# EAGLE schematic oresat-camera-card-v0 (EAGLE 9.4.2)
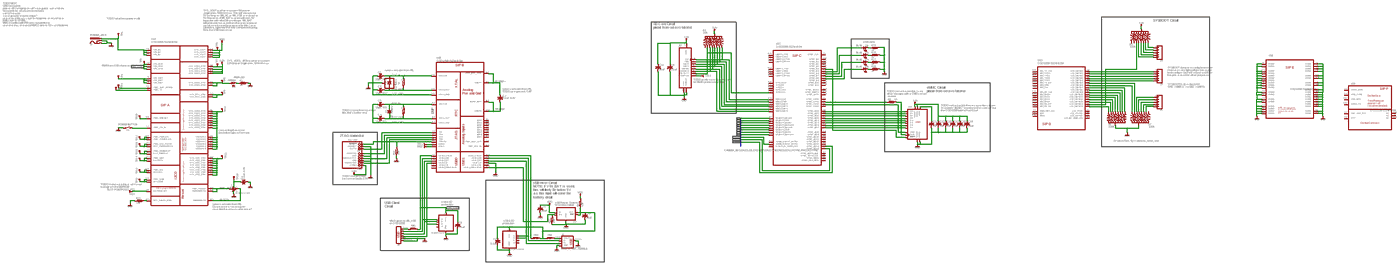
[diagram p0: schematic, sheet 1, overview]
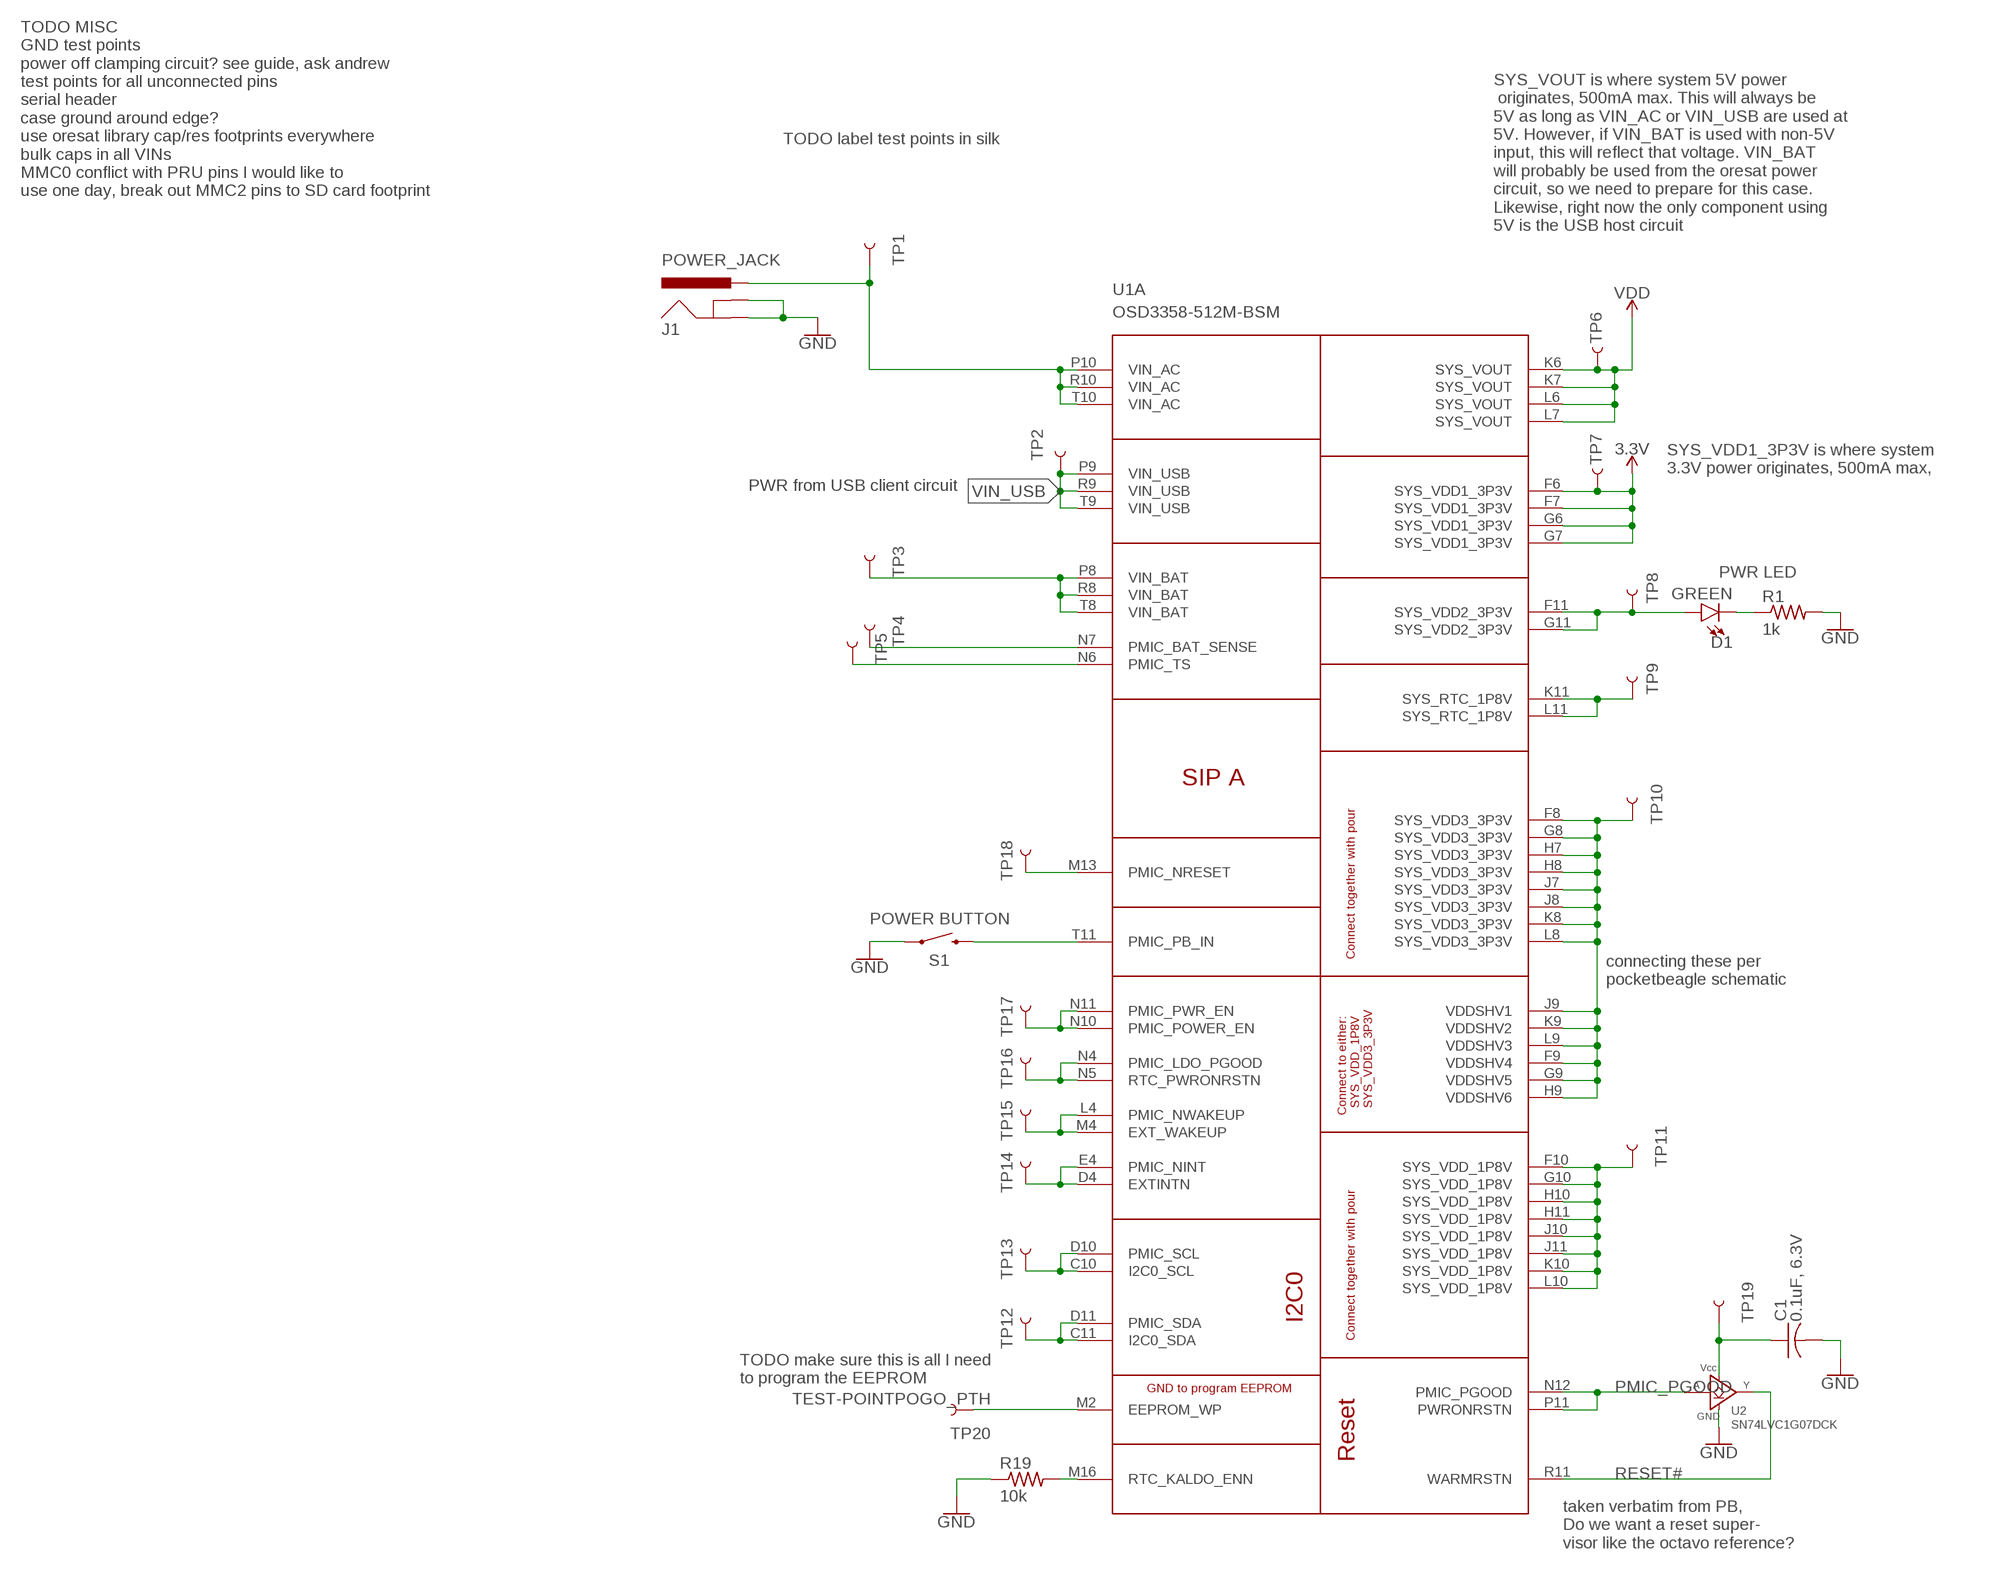
[diagram p1: schematic, sheet 1, part 1 of 4]
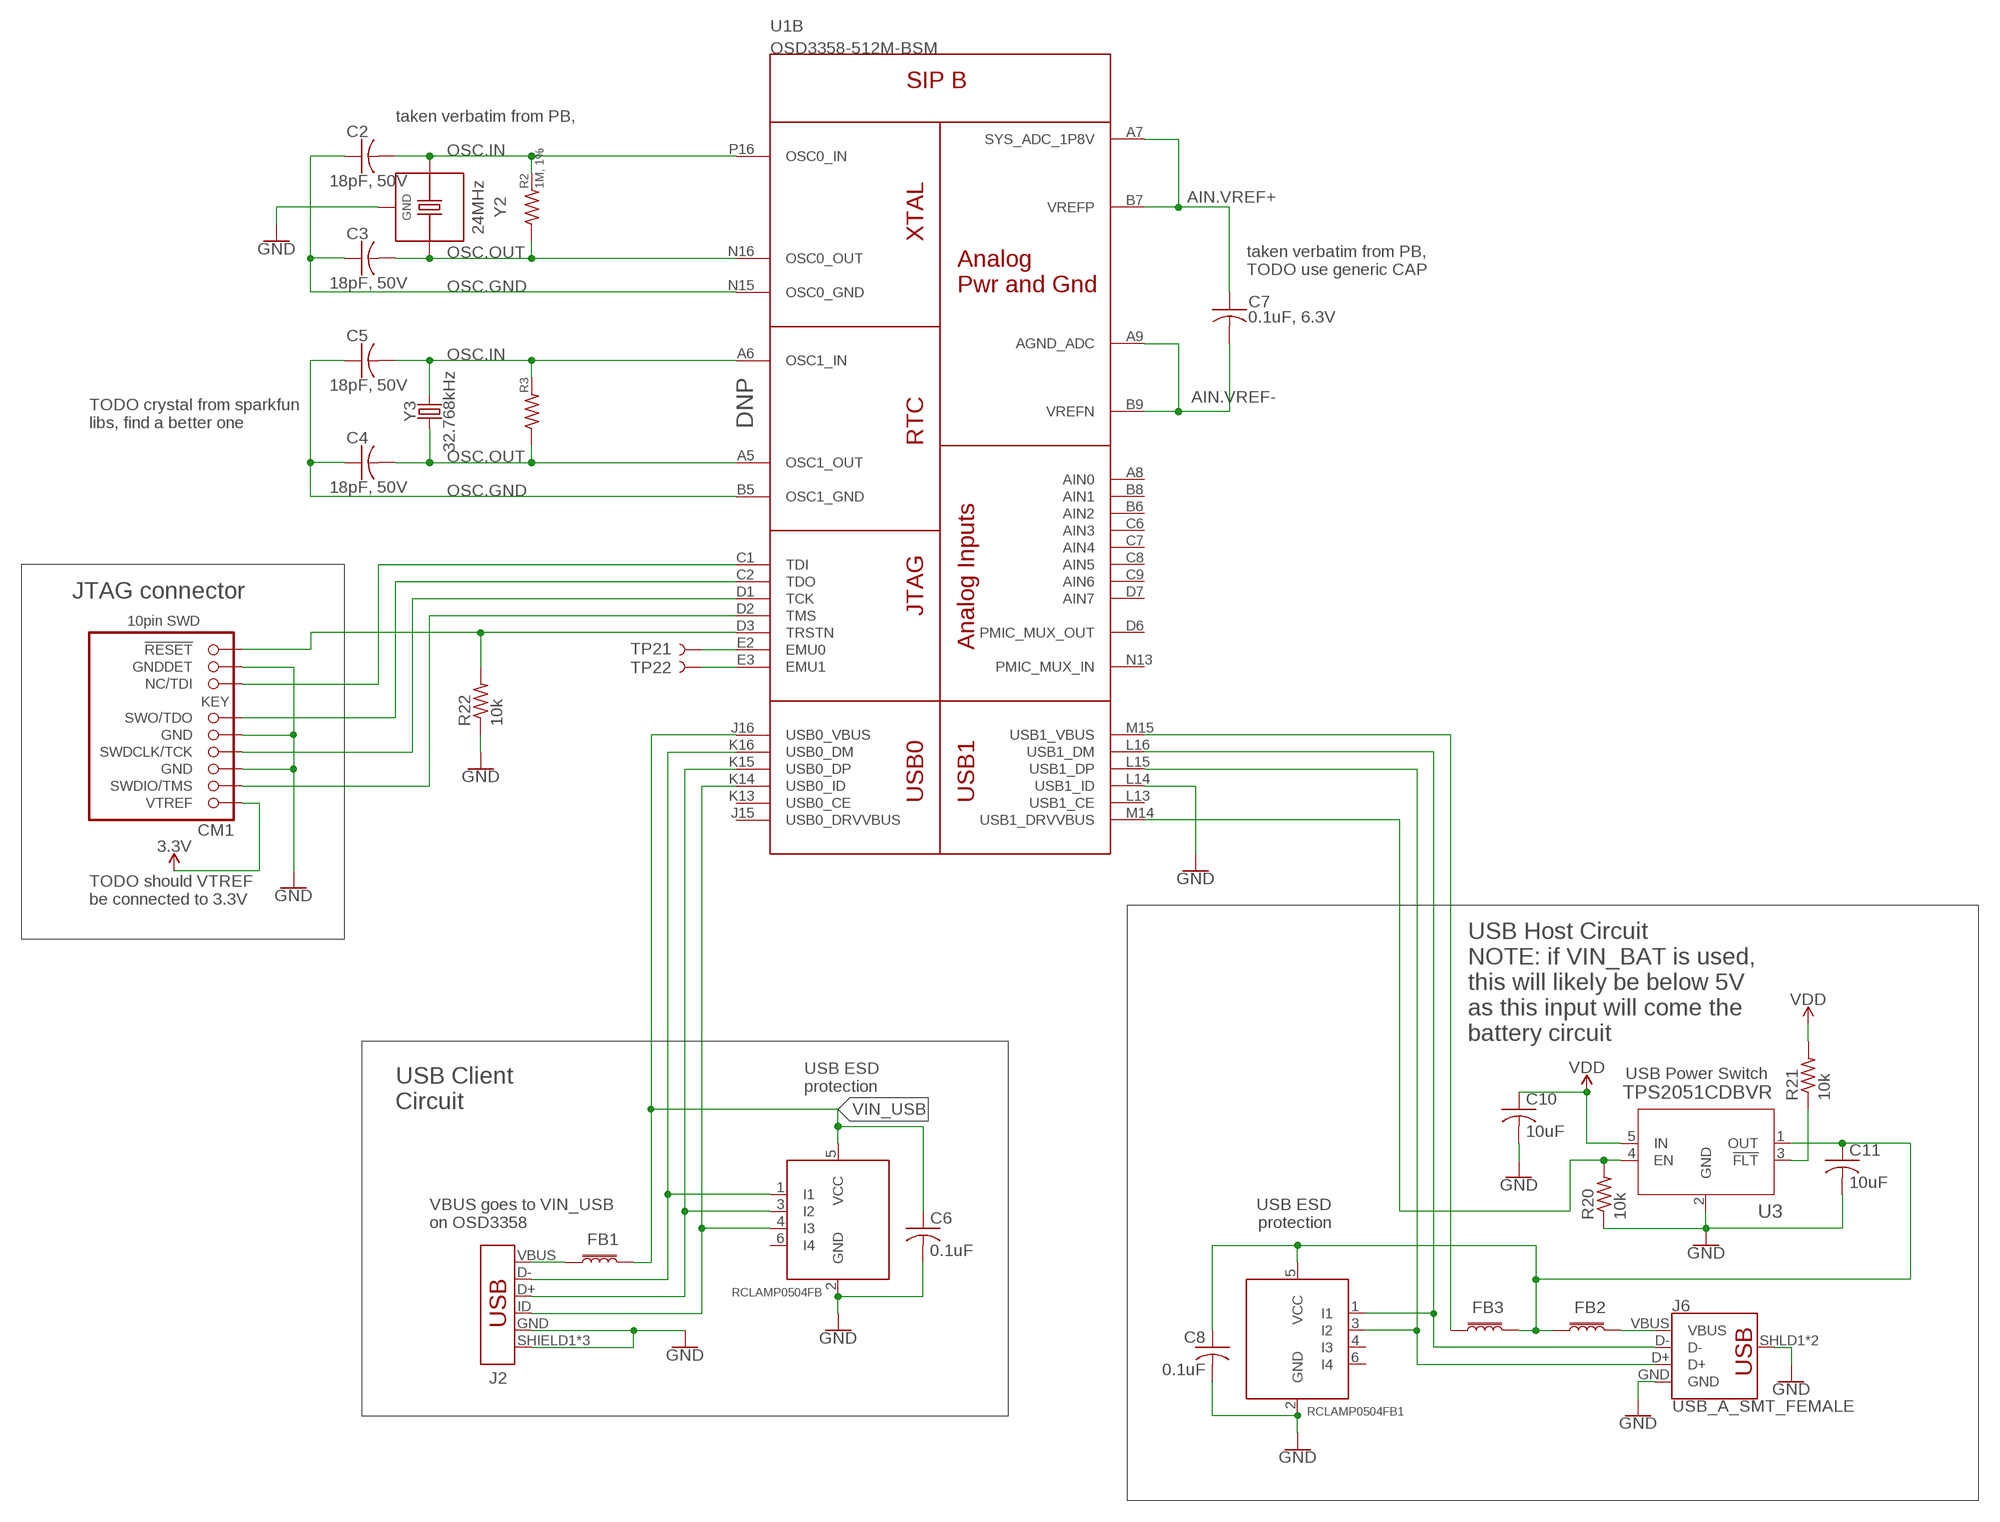
[diagram p2: schematic, sheet 1, part 2 of 4]
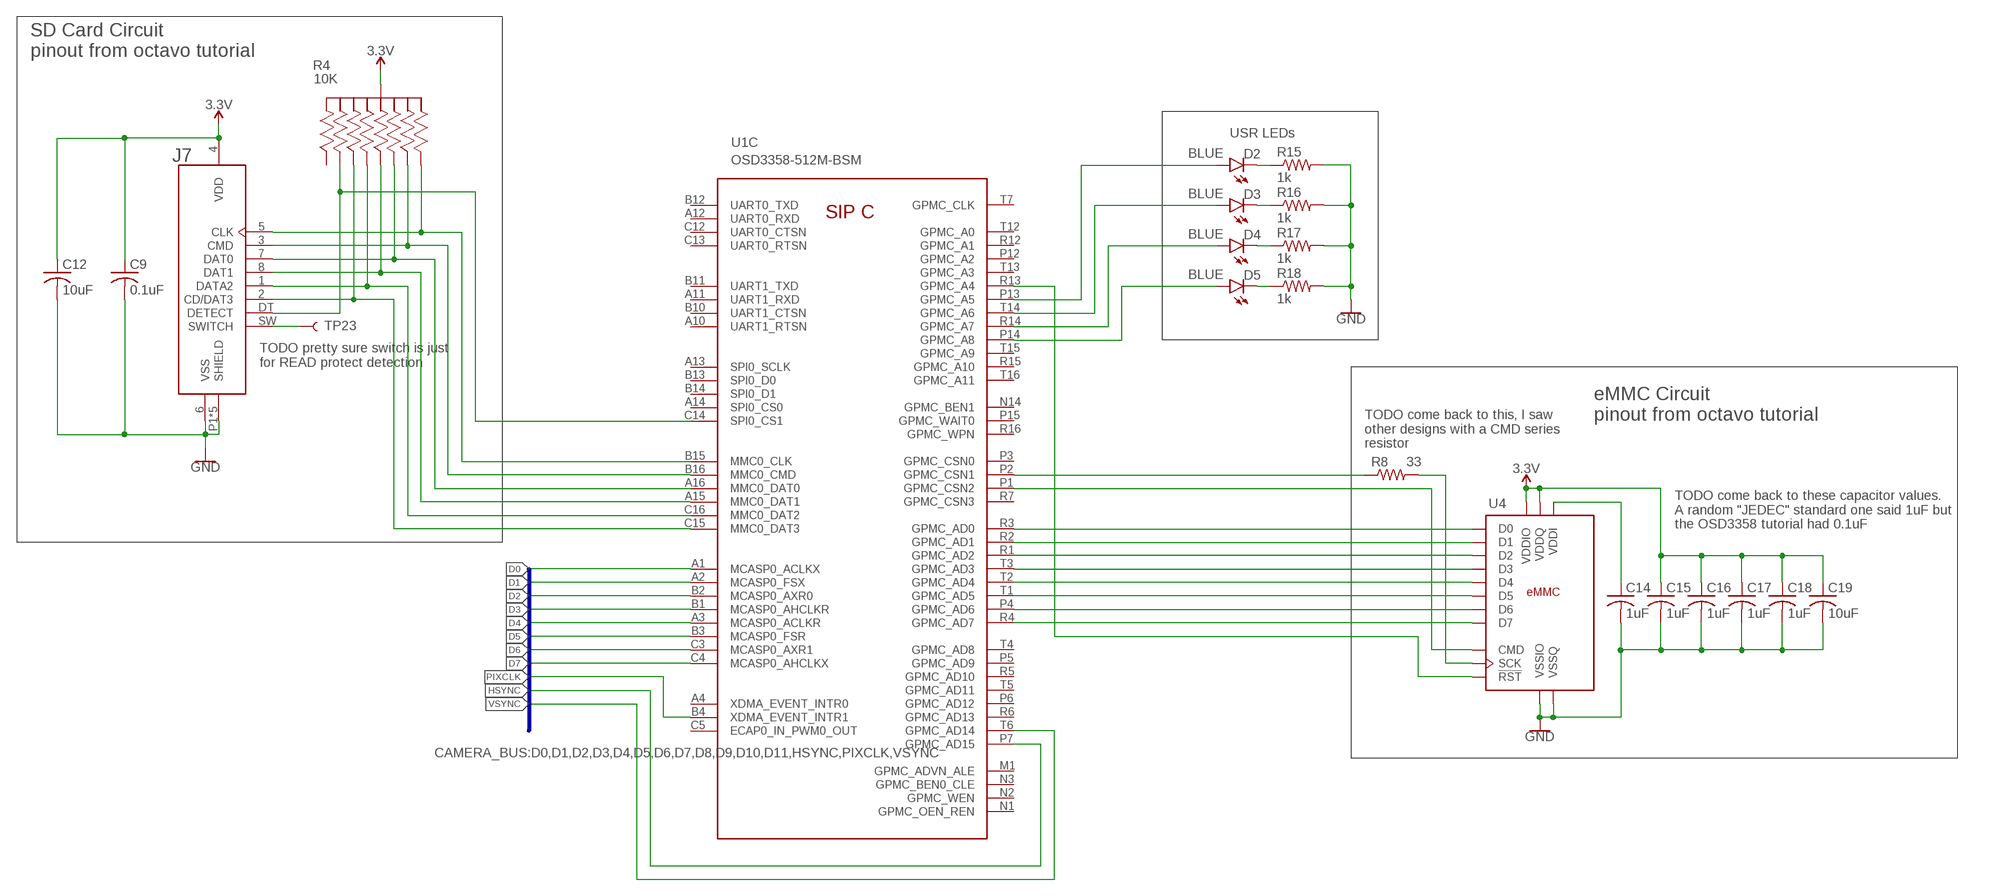
[diagram p3: schematic, sheet 1, part 3 of 4]
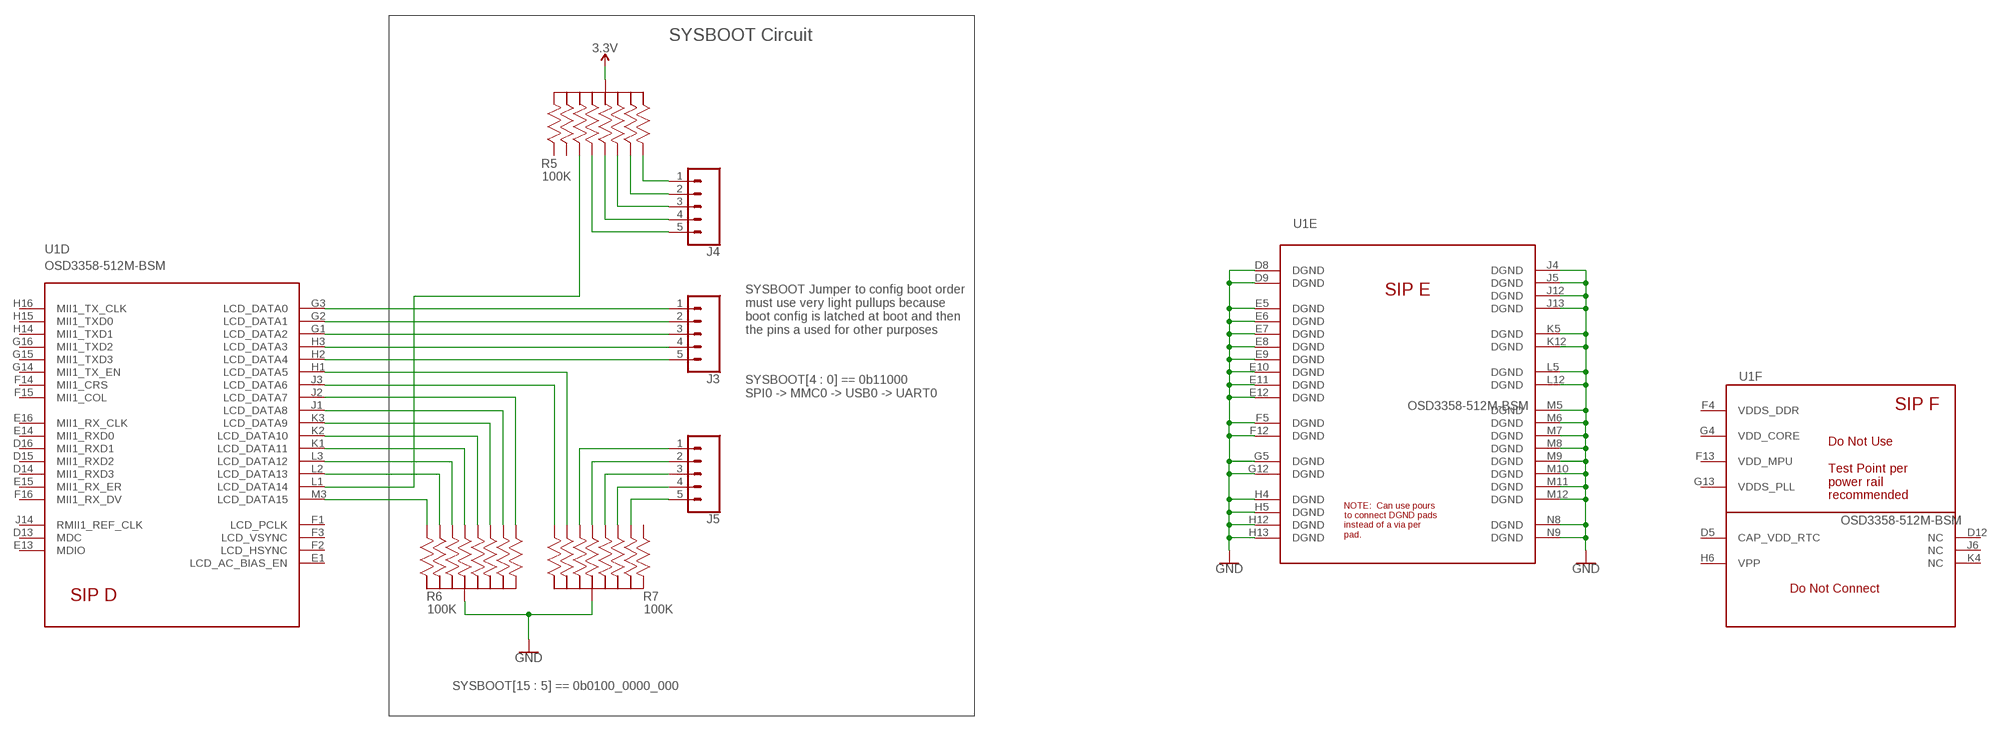
[diagram p4: schematic, sheet 1, part 4 of 4]

## Parts
C1  0.1uF, 6.3V  C-USC0603  [C0603]
C2  18pF, 50V  C-USC0603  [C0603]
C3  18pF, 50V  C-USC0603  [C0603]
C4  18pF, 50V  C-USC0603  [C0603]
C5  18pF, 50V  C-USC0603  [C0603]
C6  0.1uF  C-USC0603  [C0603]
C7  0.1uF, 6.3V  C-USC0603  [C0603]
C8  0.1uF  C-USC0603  [C0603]
C9  0.1uF  C-USC0603  [C0603]
C10  10uF  C-USC0603  [C0603]
C11  10uF  C-USC0603  [C0603]
C12  10uF  C-USC0603  [C0603]
C14  1uF  C-USC0603  [C0603]
C15  1uF  C-USC0603  [C0603]
C16  1uF  C-USC0603  [C0603]
C17  1uF  C-USC0603  [C0603]
C18  1uF  C-USC0603  [C0603]
C19  10uF  C-USC0603  [C0603]
CM1  FTSH-105-XX-X-DV-K  [CON10_2X5_DUK_FTSH]
D1  GREEN  LED-GREEN0603  [LED-0603]
D2  BLUE  LED-BLUE0603  [LED-0603]
D3  BLUE  LED-BLUE0603  [LED-0603]
D4  BLUE  LED-BLUE0603  [LED-0603]
D5  BLUE  LED-BLUE0603  [LED-0603]
FB1  30Ω/1.8A  FERRITE_BEAD-0603  [0603]
FB2  30Ω/1.8A  FERRITE_BEAD-0603  [0603]
FB3  30Ω/1.8A  FERRITE_BEAD-0603  [0603]
J1  POWER_JACK  [POWER_JACK_PTH]
J2  USB_MICRO-B_FEMALE-SMT  [USB-B-MICRO-SMD]
J3  CONN_05  [1X05]
J4  CONN_05  [1X05]
J5  CONN_05  [1X05]
J6  USB_A_SMT_FEMALE  [USB-A-S-SILK-FEMALE]
J7  503182-1852  [MOLEX_503182-1852]
R1  1k  R-US_0603-A  [.0603-A]
R2  1M, 1%  R-US_0603-A  [.0603-A]
R3  1M, 1%  R-US_0603-A  [.0603-A]
R4  10K  EXB-A10P391JC_ARRAY_EXBA-M  [ARRAY_EXBA-M]
R5  100K  EXB-A10P391JC_ARRAY_EXBA-M  [ARRAY_EXBA-M]
R6  100K  EXB-A10P391JC_ARRAY_EXBA-M  [ARRAY_EXBA-M]
R7  100K  EXB-A10P391JC_ARRAY_EXBA-M  [ARRAY_EXBA-M]
R8  33  R-US_0603-A  [.0603-A]
R15  1k  R-US_0603-A  [.0603-A]
R16  1k  R-US_0603-A  [.0603-A]
R17  1k  R-US_0603-A  [.0603-A]
R18  1k  R-US_0603-A  [.0603-A]
R19  10k  R-US_0603-A  [.0603-A]
R20  10k  R-US_0603-A  [.0603-A]
R21  10k  R-US_0603-A  [.0603-A]
R22  10k  R-US_0603-A  [.0603-A]
RCLAMP0504FB  RCLAMP0504FB  [SC70-6]
RCLAMP0504FB1  RCLAMP0504FB  [SC70-6]
S1  MOMENTARY-SWITCH-SPST-SMD-4.6X2.8MM  [TACTILE_SWITCH_SMD_4.6X2.8MM]
TP1  TEST-POINT3X4  [PAD.03X.04]
TP2  TEST-POINT3X4  [PAD.03X.04]
TP3  TEST-POINT3X4  [PAD.03X.04]
TP4  TEST-POINT3X4  [PAD.03X.04]
TP5  TEST-POINT3X4  [PAD.03X.04]
TP6  TEST-POINT3X4  [PAD.03X.04]
TP7  TEST-POINT3X4  [PAD.03X.04]
TP8  TEST-POINT3X4  [PAD.03X.04]
TP9  TEST-POINT3X4  [PAD.03X.04]
TP10  TEST-POINT3X4  [PAD.03X.04]
TP11  TEST-POINT3X4  [PAD.03X.04]
TP12  TEST-POINT3X4  [PAD.03X.04]
TP13  TEST-POINT3X4  [PAD.03X.04]
TP14  TEST-POINT3X4  [PAD.03X.04]
TP15  TEST-POINT3X4  [PAD.03X.04]
TP16  TEST-POINT3X4  [PAD.03X.04]
TP17  TEST-POINT3X4  [PAD.03X.04]
TP18  TEST-POINT3X4  [PAD.03X.04]
TP19  TEST-POINT3X4  [PAD.03X.04]
TP20  TEST-POINTPOGO_PTH  [1X01_NO_SILK]
TP21  TEST-POINT3X4  [PAD.03X.04]
TP22  TEST-POINT3X4  [PAD.03X.04]
TP23  TEST-POINT3X4  [PAD.03X.04]
U1  OSD3358-512M-BSM  [OSD335X-BGA-256]
U2  SN74LVC1G07DCK  [SC70(TI-DCK)]
U3  TPS2051CDBVR  [DBV5]
U4  EMMC+RESET-BA  [BGA-153(11.5X13)(EMMC-BA)]
Y2  24MHz  ECS-240-12-30BQ-AEN-TR  [5X3.2-4SMD]
Y3  32.768kHz  CRYSTAL-32.768KHZSMD-3.2X1.5  [CRYSTAL-SMD-3.2X1.5MM]

## Nets
3.3V: C9.1 C12.1 C15.1 C16.1 C17.1 C18.1 C19.1 CM1.1(VTREF) J7.4(VDD) R4.5 R4.10 R5.5 R5.10 TP7.P$1 U1.F6(A:SYS_VDD1_3P3V) U1.F7(A:SYS_VDD1_3P3V) U1.G6(A:SYS_VDD1_3P3V) U1.G7(A:SYS_VDD1_3P3V) U4.C6(VDDQ) U4.E6(VDDIO) U4.F5(VDDIO) U4.J10(VDDIO) U4.K9(VDDIO) U4.M4(VDDQ) U4.N4(VDDQ) U4.P3(VDDQ) U4.P5(VDDQ)
5V: C10.1 R21.2 TP6.P$1 U1.K6(A:SYS_VOUT) U1.K7(A:SYS_VOUT) U1.L6(A:SYS_VOUT) U1.L7(A:SYS_VOUT) U3.5(IN) ; supply symbol labelled VDD
AIN.VREF+: C7.1 U1.A7(B:SYS_ADC_1P8V) U1.B7(B:VREFP)
AIN.VREF-: C7.2 U1.A9(B:AGND_ADC) U1.B9(B:VREFN)
D0: U1.A1(C:MCASP0_ACLKX)
D1: U1.A2(C:MCASP0_FSX)
D2: U1.B2(C:MCASP0_AXR0)
D3: U1.B1(C:MCASP0_AHCLKR)
D4: U1.A3(C:MCASP0_ACLKR)
D5: U1.B3(C:MCASP0_FSR)
D6: U1.C3(C:MCASP0_AXR1)
D7: U1.C4(C:MCASP0_AHCLKX)
GND: C1.2 C6.2 C8.2 C9.2 C10.2 C11.2 C12.2 C14.2 C15.2 C16.2 C17.2 C18.2 C19.2 CM1.3(GND) CM1.5(GND) CM1.9(GNDDET) J1.GND J1.GNDBREAK J2.GND J2.SHIELD1(SHIELD) J2.SHIELD2(SHIELD) J2.SHIELD3(SHIELD) J6.GND J6.SHLD1(SHIELD) J6.SHLD2(SHIELD) J7.6(VSS) J7.P1(SHIELD) J7.P2(SHIELD) J7.P3(SHIELD) J7.P4(SHIELD) J7.P5(SHIELD) R1.2 R6.5 R6.10 R7.5 R7.10 R15.2 R16.2 R17.2 R18.2 R19.1 R20.1 R22.1 RCLAMP0504FB1.2(GND) RCLAMP0504FB.2(GND) S1.1 S1.2 U1.D8(E:DGND) U1.D9(E:DGND) U1.E5(E:DGND) U1.E6(E:DGND) U1.E7(E:DGND) U1.E8(E:DGND) U1.E9(E:DGND) U1.E10(E:DGND) U1.E11(E:DGND) U1.E12(E:DGND) U1.F5(E:DGND) U1.F12(E:DGND) U1.G5(E:DGND) U1.G12(E:DGND) U1.H4(E:DGND) U1.H5(E:DGND) U1.H12(E:DGND) U1.H13(E:DGND) U1.J4(E:DGND) U1.J5(E:DGND) U1.J12(E:DGND) U1.J13(E:DGND) U1.K5(E:DGND) U1.K12(E:DGND) U1.L5(E:DGND) U1.L12(E:DGND) U1.L14(B:USB1_ID) U1.M5(E:DGND) U1.M6(E:DGND) U1.M7(E:DGND) U1.M8(E:DGND) U1.M9(E:DGND) U1.M10(E:DGND) U1.M11(E:DGND) U1.M12(E:DGND) U1.N8(E:DGND) U1.N9(E:DGND) U2.3(GND) U3.2(GND) U4.C4(VSSQ) U4.E7(VSSIO) U4.G5(VSSIO) U4.H10(VSSIO) U4.K8(VSSIO) U4.N2(VSSQ) U4.N5(VSSQ) U4.P4(VSSQ) U4.P6(VSSQ) Y2.2(GND) Y2.4(GND)
HSYNC: U1.P7(C:GPMC_AD15)
N$1: J1.PWR TP1.P$1 U1.P10(A:VIN_AC) U1.R10(A:VIN_AC) U1.T10(A:VIN_AC)
N$2: FB1.1 J2.VBUS
N$3: TP3.P$1 U1.P8(A:VIN_BAT) U1.R8(A:VIN_BAT) U1.T8(A:VIN_BAT)
N$4: D1.A TP8.P$1 U1.F11(A:SYS_VDD2_3P3V) U1.G11(A:SYS_VDD2_3P3V)
N$5: TP4.P$1 U1.N7(A:PMIC_BAT_SENSE)
N$6: TP5.P$1 U1.N6(A:PMIC_TS)
N$7: TP9.P$1 U1.K11(A:SYS_RTC_1P8V) U1.L11(A:SYS_RTC_1P8V)
N$8: TP11.P$1 U1.F10(A:SYS_VDD_1P8V) U1.G10(A:SYS_VDD_1P8V) U1.H10(A:SYS_VDD_1P8V) U1.H11(A:SYS_VDD_1P8V) U1.J10(A:SYS_VDD_1P8V) U1.J11(A:SYS_VDD_1P8V) U1.K10(A:SYS_VDD_1P8V) U1.L10(A:SYS_VDD_1P8V)
N$9: TP12.P$1 U1.C11(A:I2C0_SDA) U1.D11(A:PMIC_SDA)
N$10: TP10.P$1 U1.F8(A:SYS_VDD3_3P3V) U1.F9(A:VDDSHV4) U1.G8(A:SYS_VDD3_3P3V) U1.G9(A:VDDSHV5) U1.H7(A:SYS_VDD3_3P3V) U1.H8(A:SYS_VDD3_3P3V) U1.H9(A:VDDSHV6) U1.J7(A:SYS_VDD3_3P3V) U1.J8(A:SYS_VDD3_3P3V) U1.J9(A:VDDSHV1) U1.K8(A:SYS_VDD3_3P3V) U1.K9(A:VDDSHV2) U1.L8(A:SYS_VDD3_3P3V) U1.L9(A:VDDSHV3)
N$11: D1.C R1.1
N$12: TP13.P$1 U1.C10(A:I2C0_SCL) U1.D10(A:PMIC_SCL)
N$13: TP14.P$1 U1.D4(A:EXTINTN) U1.E4(A:PMIC_NINT)
N$14: TP15.P$1 U1.L4(A:PMIC_NWAKEUP) U1.M4(A:EXT_WAKEUP)
N$15: TP16.P$1 U1.N4(A:PMIC_LDO_PGOOD) U1.N5(A:RTC_PWRONRSTN)
N$16: TP17.P$1 U1.N10(A:PMIC_POWER_EN) U1.N11(A:PMIC_PWR_EN)
N$17: S1.3 S1.4 U1.T11(A:PMIC_PB_IN)
N$18: TP18.P$1 U1.M13(A:PMIC_NRESET)
N$19: CM1.8(NC/TDI) U1.C1(B:TDI)
N$20: CM1.6(SWO/TDO) U1.C2(B:TDO)
N$21: CM1.4(SWDCLK/TCK) U1.D1(B:TCK)
N$22: CM1.2(SWDIO/TMS) U1.D2(B:TMS)
N$23: J7.5(CLK) R4.6 U1.B15(C:MMC0_CLK)
N$24: J3.1 U1.G3(D:LCD_DATA0)
N$25: J3.2 U1.G2(D:LCD_DATA1)
N$26: J3.3 U1.G1(D:LCD_DATA2)
N$27: J3.4 U1.H3(D:LCD_DATA3)
N$28: J3.5 U1.H2(D:LCD_DATA4)
N$29: R7.4 U1.H1(D:LCD_DATA5)
N$30: R7.6 U1.J3(D:LCD_DATA6)
N$31: R6.1 U1.J2(D:LCD_DATA7)
N$32: R6.9 U1.J1(D:LCD_DATA8)
N$33: R6.2 U1.K3(D:LCD_DATA9)
N$34: R6.8 U1.K2(D:LCD_DATA10)
N$35: R6.3 U1.K1(D:LCD_DATA11)
N$36: R6.7 U1.L3(D:LCD_DATA12)
N$37: R6.4 U1.L2(D:LCD_DATA13)
N$38: R5.2 U1.L1(D:LCD_DATA14)
N$39: R6.6 U1.M3(D:LCD_DATA15)
N$40: D2.C R15.1
N$41: D3.C R16.1
N$42: D4.C R17.1
N$43: D5.C R18.1
N$44: D2.A U1.P13(C:GPMC_A5)
N$45: D3.A U1.T14(C:GPMC_A6)
N$46: D4.A U1.R14(C:GPMC_A7)
N$47: D5.A U1.P14(C:GPMC_A8)
N$48: R19.2 U1.M16(A:RTC_KALDO_ENN)
N$49: TP20.1 U1.M2(A:EEPROM_WP)
N$50: J2.D- RCLAMP0504FB.1(I1) U1.K16(B:USB0_DM)
N$51: J2.D+ RCLAMP0504FB.3(I2) U1.K15(B:USB0_DP)
N$52: J2.ID RCLAMP0504FB.4(I3) U1.K14(B:USB0_ID)
N$53: R20.2 U1.M14(B:USB1_DRVVBUS) U3.4(EN)
N$54: FB2.2 J6.VBUS
N$55: R21.1 U3.3(!FLT)
N$56: FB3.1 U1.M15(B:USB1_VBUS)
N$57: J6.D- RCLAMP0504FB1.1(I1) U1.L16(B:USB1_DM)
N$58: J6.D+ RCLAMP0504FB1.3(I2) U1.L15(B:USB1_DP)
N$59: TP22.P$1 U1.E3(B:EMU1)
N$60: J7.3(CMD) R4.4 U1.B16(C:MMC0_CMD)
N$61: J7.7(DAT0) R4.7 U1.A16(C:MMC0_DAT0)
N$62: J7.8(DAT1) R4.3 U1.A15(C:MMC0_DAT1)
N$63: J7.1(DATA2) R4.8 U1.C16(C:MMC0_DAT2)
N$64: J7.2(CD/DAT3) R4.2 U1.C15(C:MMC0_DAT3)
N$65: J7.DT(DETECT) R4.9 U1.C14(C:SPI0_CS1)
N$66: J5.1 R7.7
N$67: J5.2 R7.3
N$68: J5.3 R7.8
N$69: J5.4 R7.2
N$70: J5.5 R7.9
N$71: J4.1 R5.6
N$72: J4.2 R5.4
N$73: J4.3 R5.7
N$74: J4.4 R5.3
N$75: J4.5 R5.8
N$76: C14.1 U4.C2(VDDI)
N$77: U1.R3(C:GPMC_AD0) U4.A3(D0)
N$78: U1.R2(C:GPMC_AD1) U4.A4(D1)
N$79: U1.R1(C:GPMC_AD2) U4.A5(D2)
N$80: U1.T3(C:GPMC_AD3) U4.B2(D3)
N$81: U1.T2(C:GPMC_AD4) U4.B3(D4)
N$82: U1.T1(C:GPMC_AD5) U4.B4(D5)
N$83: U1.P4(C:GPMC_AD6) U4.B5(D6)
N$84: U1.R4(C:GPMC_AD7) U4.B6(D7)
N$85: U1.P1(C:GPMC_CSN2) U4.M5(CMD)
N$86: R8.1 U1.P2(C:GPMC_CSN1)
N$87: R8.2 U4.M6(SCK)
N$88: U1.R13(C:GPMC_A4) U4.K5(!RST!)
N$89: CM1.10(!RESET) R22.2 U1.D3(B:TRSTN)
N$90: TP21.P$1 U1.E2(B:EMU0)
N$91: J7.SW(SWITCH) TP23.P$1
OSC.GND: C2.1 C3.1 C4.1 C5.1 U1.B5(B:OSC1_GND) U1.N15(B:OSC0_GND)
OSC.IN: C2.2 C5.2 R2.2 R3.2 U1.A6(B:OSC1_IN) U1.P16(B:OSC0_IN) Y2.1(X1) Y3.P$2
OSC.OUT: C3.2 C4.2 R2.1 R3.1 U1.A5(B:OSC1_OUT) U1.N16(B:OSC0_OUT) Y2.3(X2) Y3.P$1
PIXCLK: U1.B4(C:XDMA_EVENT_INTR1)
PMIC_PGOOD: U1.N12(A:PMIC_PGOOD) U1.P11(A:PWRONRSTN) U2.2(A)
RESET#: U1.R11(A:WARMRSTN) U2.4(Y)
VDD_RTC: C1.1 TP19.P$1 U2.5(VCC)
VIN_USB: C6.1 C8.1 C11.1 FB1.2 FB2.1 FB3.2 RCLAMP0504FB1.5(VCC) RCLAMP0504FB.5(VCC) TP2.P$1 U1.J16(B:USB0_VBUS) U1.P9(A:VIN_USB) U1.R9(A:VIN_USB) U1.T9(A:VIN_USB) U3.1(OUT)
VSYNC: U1.T6(C:GPMC_AD14)
Unconnected: R4.1 R5.1 R5.9 R7.1 RCLAMP0504FB1.4(I3) RCLAMP0504FB1.6(I4) RCLAMP0504FB.6(I4) U1.A4(C:XDMA_EVENT_INTR0) U1.A8(B:AIN0) U1.A10(C:UART1_RTSN) U1.A11(C:UART1_RXD) U1.A12(C:UART0_RXD) U1.A13(C:SPI0_SCLK) U1.A14(C:SPI0_CS0) U1.B6(B:AIN2) U1.B8(B:AIN1) U1.B10(C:UART1_CTSN) U1.B11(C:UART1_TXD) U1.B12(C:UART0_TXD) U1.B13(C:SPI0_D0) U1.B14(C:SPI0_D1) U1.C5(C:ECAP0_IN_PWM0_OUT) U1.C6(B:AIN3) U1.C7(B:AIN4) U1.C8(B:AIN5) U1.C9(B:AIN6) U1.C12(C:UART0_CTSN) U1.C13(C:UART0_RTSN) U1.D5(F:CAP_VDD_RTC) U1.D6(B:PMIC_MUX_OUT) U1.D7(B:AIN7) U1.D12(F:NC) U1.D13(D:MDC) U1.D14(D:MII1_RXD3) U1.D15(D:MII1_RXD2) U1.D16(D:MII1_RXD1) U1.E1(D:LCD_AC_BIAS_EN) U1.E13(D:MDIO) U1.E14(D:MII1_RXD0) U1.E15(D:MII1_RX_ER) U1.E16(D:MII1_RX_CLK) U1.F1(D:LCD_PCLK) U1.F2(D:LCD_HSYNC) U1.F3(D:LCD_VSYNC) U1.F4(F:VDDS_DDR) U1.F13(F:VDD_MPU) U1.F14(D:MII1_CRS) U1.F15(D:MII1_COL) U1.F16(D:MII1_RX_DV) U1.G4(F:VDD_CORE) U1.G13(F:VDDS_PLL) U1.G14(D:MII1_TX_EN) U1.G15(D:MII1_TXD3) U1.G16(D:MII1_TXD2) U1.H6(F:VPP) U1.H14(D:MII1_TXD1) U1.H15(D:MII1_TXD0) U1.H16(D:MII1_TX_CLK) U1.J6(F:NC) U1.J14(D:RMII1_REF_CLK) U1.J15(B:USB0_DRVVBUS) U1.K4(F:NC) U1.K13(B:USB0_CE) U1.L13(B:USB1_CE) U1.M1(C:GPMC_ADVN_ALE) U1.N1(C:GPMC_OEN_REN) U1.N2(C:GPMC_WEN) U1.N3(C:GPMC_BEN0_CLE) U1.N13(B:PMIC_MUX_IN) U1.N14(C:GPMC_BEN1) U1.P3(C:GPMC_CSN0) U1.P5(C:GPMC_AD9) U1.P6(C:GPMC_AD12) U1.P12(C:GPMC_A2) U1.P15(C:GPMC_WAIT0) U1.R5(C:GPMC_AD10) U1.R6(C:GPMC_AD13) U1.R7(C:GPMC_CSN3) U1.R12(C:GPMC_A1) U1.R15(C:GPMC_A10) U1.R16(C:GPMC_WPN) U1.T4(C:GPMC_AD8) U1.T5(C:GPMC_AD11) U1.T7(C:GPMC_CLK) U1.T12(C:GPMC_A0) U1.T13(C:GPMC_A3) U1.T15(C:GPMC_A9) U1.T16(C:GPMC_A11)

## Buses
CAMERA_BUS:D0,D1,D2,D3,D4,D5,D6,D7,D8,D9,D10,D11,HSYNC,PIXCLK,VSYNC

## Notes on the sheet
- TODO label test points in silk
- SYSBOOT Circuit
- TODO MISC
  GND test points
  power off clamping circuit? see guide, ask andrew
  test points for all unconnected pins
  serial header
  case ground around edge?
  use oresat library cap/res footprints everywhere
  bulk caps in all VINs
  MMC0 conflict with PRU pins I would like to
  use one day, break out MMC2 pins to SD card footprint
- SD Card Circuit
  pinout from octavo tutorial
- SYS_VOUT is where system 5V power
   originates, 500mA max. This will always be 
  5V as long as VIN_AC or VIN_USB are used at
  5V. However, if VIN_BAT is used with non-5V
  input, this will reflect that voltage. VIN_BAT
  will probably be used from the oresat power
  circuit, so we need to prepare for this case.
  Likewise, right now the only component using 
  5V is the USB host circuit
- USR LEDs
- SYS_VDD1_3P3V is where system 
  3.3V power originates, 500mA max,
- PWR from USB client circuit
- taken verbatim from PB,
- SYSBOOT Jumper to config boot order
  must use very light pullups because 
  boot config is latched at boot and then
  the pins a used for other purposes
- PWR LED
- TODO pretty sure switch is just 
  for READ protect detection
- SYSBOOT[4 : 0] == 0b11000
  SPI0 -> MMC0 -> USB0 -> UART0
- taken verbatim from PB,
  TODO use generic CAP
- eMMC Circuit
  pinout from octavo tutorial
- TODO come back to this, I saw
  other designs with a CMD series
  resistor
- TODO come back to these capacitor values. 
  A random "JEDEC" standard one said 1uF but
  the OSD3358 tutorial had 0.1uF
- TODO crystal from sparkfun 
  libs, find a better one
- DNP
- POWER BUTTON
- connecting these per 
  pocketbeagle schematic
- JTAG connector
- SYSBOOT[15 : 5] == 0b0100_0000_000
- TODO should VTREF 
  be connected to 3.3V
- TODO make sure this is all I need 
  to program the EEPROM
- USB Host Circuit
  NOTE: if VIN_BAT is used,
  this will likely be below 5V
  as this input will come the 
  battery circuit
- USB Power Switch
- USB ESD
  protection
- USB Client 
  Circuit
- taken verbatim from PB,
  Do we want a reset super-
  visor like the octavo reference?
- VBUS goes to VIN_USB
  on OSD3358
- USB ESD
  protection

## Library data of the parts
C1-C12 C14-C19 = oresat-rcl:C-US: CAPACITOR, American symbol
CM1 = J-Samtec-FTSH-105-XXX-DV-K-ARM-SWD:FTSH-105-XX-X-DV-K
D1 = SparkFun-LED:LED-GREEN: Green SMD LED Used in manufacturing of various products at SparkFun Packages: 0603 - SMD 0603 package [Product Link] <http://www.futureelectronics.com/en/technologies/semiconductors/optoelectronics/leds/Pages/9894312-LTST-C190GKT.aspx?CrossPart=HSMG-C190&IM=0> LilyPad 1206 - SMD1206 LilyPad package [Product Link] <http://www.futureelectronics.com/en/Technologies/Product.aspx?ProductID=IN150NGHARVATEKCORPORATION2049943&IM=0> 1206 - SMD1206 package [Product Link] <http://www.futureelectronics.com/en/technologies/semiconductors/optoelectronics/leds/Pages/8315665-LTST-C150KGKT.aspx?IM=0> 1206 Bottom Mount -SMD 1206 Bottom Mount [Product Link] <http://www.digikey.com/product-detail/en/lite-on-inc/LTST-C230KGKT/160-1456-1-ND/386854> SparkFun Products: Pro Mini 328 -5V <https://www.sparkfun.com/products/821> RedBoard <https://www.sparkfun.com/products/12757> MP3 Trigger <https://www.sparkfun.com/products/13720> Makey Makey <https://www.sparkfun.com/products/11076>; PROD_ID: DIO-00821
D2-D5 = SparkFun-LED:LED-BLUE: Blue SMD LED Used in manufacturing of various products at SparkFun Packages: 0603 - SMD 0603 package [Product Link] <http://www.digikey.com/product-detail/en/SMLE12BC7TT86/511-1589-2-ND/1641808> 1206 - SMD1206 package [Product Link] <http://www.digikey.com/product-detail/en/lite-on-inc/LTST-C150TBKT/160-1643-1-ND/573584> SparkFun Products: ESP8266 Thing-Dev Board <https://www.sparkfun.com/products/13711> RedBoard <https://www.sparkfun.com/products/12757>; PROD_ID: DIO-08575
FB1-FB3 = SparkFun-Coils:FERRITE_BEAD: Ferrite Bead (blocks, cores, rings, chokes, etc.) Inductor with layers of ferrite used to suppress high frequencies. Often used to isolate high frequency noise. SparkFun Products: IOIO-OTG - V2.2 <https://www.sparkfun.com/products/13613> SparkFun SAMD21 Mini Breakout <https://www.sparkfun.com/products/13664> SparkFun 6 Degrees of Freedom Breakout - LSM6DS3 <https://www.sparkfun.com/products/13339> SparkFun SAMD21 Dev Breakout <https://www.sparkfun.com/products/13672>; PROD_ID: NDUC-13805
J1 = SparkFun-Connectors:POWER_JACK: Power Jack Connector This is the standard 5.5mm barrel jack for power. The PTH is the most common, proven, reliable, footprint. The Slot footprint only works if the mill layer is transmitted to the PCB fab house so be warned. Here are the connectors we sell at SparkFun: DC Barrel Power Jack/Connector <https://www.sparkfun.com/products/119> (PRT-00119) DC Barrel Power Jack/Connector (SMD) <https://www.sparkfun.com/products/12748> (PRT-12748) DC Barrel Jack Adapter - Breadboard Compatible <https://www.sparkfun.com/products/10811> (PRT-10811) It is used on this SparkFun product (and many, many others): SparkFun RedBoard - Programmed with Arduino <https://www.sparkfun.com/products/12757> (DEV-12757) Also, if you need a mating power supply or connector, please check these out: Wall Adapter Power Supply - 9VDC 650mA <https://www.sparkfun.com/products/298> (TOL-00298) DC Barrel Jack Adapter - Male <https://www.sparkfun.com/products/10287> (PRT-10287); PROD_ID: CONN-08197
J2 = SparkFun-Connectors:USB_MICRO-B: USB Type Micro-B Connector Male/female and PTH/SMT variants SparkFun Products: SparkFun microB USB Breakout <https://www.sparkfun.com/products/12035> SparkFun USB microB Plug Breakout <https://www.sparkfun.com/products/10031> SparkFun ESP8266 Thing <https://www.sparkfun.com/products/13231>; PROD_ID: CONN-11752
J3-J5 = SparkFun-Connectors:CONN_05: Multi connection point. Often used as Generic Header-pin footprint for 0.1 inch spaced/style header connections On any of the 0.1 inch spaced packages, you can populate with these: Break Away Headers - Straight <https://www.sparkfun.com/products/116> (PRT-00116) Break Away Male Headers - Right Angle <https://www.sparkfun.com/products/553> (PRT-00553) Female Headers <https://www.sparkfun.com/products/115> (PRT-00115) Break Away Headers - Machine Pin <https://www.sparkfun.com/products/117> (PRT-00117) Break Away Female Headers - Swiss Machine Pin <https://www.sparkfun.com/products/743> (PRT-00743) For SCREWTERMINALS and SPRING TERMINALS visit here: Screw Terimnals on SparkFun.com <https://www.sparkfun.com/search/results?term=Screw+Terminals> (5mm/3.5mm/2.54mm spacing) This device is also useful as a general connection point to wire up your design to another part of your project. Our various solder wires solder well into these plated through hole pads. Hook-Up Wire - Assortment (Stranded, 22 AWG) <https://www.sparkfun.com/products/11375> (PRT-11375) Hook-Up Wire - Assortment (Solid Core, 22 AWG) <https://www.sparkfun.com/products/11367> (PRT-11367) View the entire wire category on our website here <https://www.sparkfun.com/categories/141> Special notes: Molex polarized connector foot print use with SKU : PRT-08231 with associated crimp pins and housings. 1MM SMD Version SKU: PRT-10208
J6 = SparkFun-Connectors:USB_A: USB-A Connector Male and female variants, as well as PTH and SMT variants SparkFun Products: SparkFun XBee Explorer Dongle <https://www.sparkfun.com/products/11697> PTH Male SparkFun MicroView-USB Programmer <https://www.sparkfun.com/products/12924> SMT Male SparkFun USB Type A Female Breakout <https://www.sparkfun.com/products/12700> SMT Female; PROD_ID: CONN-09520; SF_ID: PRT-09011
J7 = J-Molex-micro-sd-503182-1852:503182-1852: Conn Micro SD Card M 8 POS 1.09mm Solder RA SMD Embossed T/R 0.5A/Contact; DESCRIPTION: MICRO SD NORMAL ULTRALOWPRO8CKTE; DIGI-KEY_PART_NUMBER: WM12834CT-ND; DIGI-KEY_PURCHASE_URL: https://www.digikey.com/product-detail/en/molex/5031821852/WM12834CT-ND/5823232?utm_source=snapeda&utm_medium=aggregator&utm_campaign=symbol; MF: Molex; MP: 5031821852; PACKAGE: None
R1-R3 R8 R15-R22 = oresat-rcl:R-US_: RESISTOR, American symbol
R4-R7 = R-Panasonic-EXB_A10PXXXJ:EXB-A10P391J; MANUFACTURER_PART_NUMBER: EXBA10P391J; VENDOR: Panasonic
RCLAMP0504FB RCLAMP0504FB1 = U-Semtec-RCLAMP0504FB:RCLAMP0504FB
S1 = SparkFun-Switches:MOMENTARY-SWITCH-SPST: Momentary Switch (Pushbutton) - SPST Normally-open (NO) SPST momentary switches (buttons, pushbuttons). Variants PTH-12MM - 12mm square, through-hole Momentary Pushbutton Switch - 12mm Square <https://www.sparkfun.com/products/9190> (COM-09190) PTH-6.0MM, PTH-6.0MM-KIT - 6.0mm square, through-hole Mini Pushbutton Switch <https://www.sparkfun.com/products/97> (COM-00097) KIT package intended for soldering kit's - only one side of pads' copper is exposed. PTH-RIGHT-ANGLE-KIT - Right-angle, through-hole Right Angle Tactile Button <https://www.sparkfun.com/products/10791> - Used on SparkFun BigTime Watch Kit <https://www.sparkfun.com/products/11734> SMD-12MM - 12mm square, surface-mount Tactile Button - SMD (12mm) <https://www.sparkfun.com/products/12993> (COM-12993) Used on SparkFun PicoBoard <https://www.sparkfun.com/products/11888> SMD-4.5MM - 4.5mm Square Trackball Switch Used on SparkFun Blackberry Trackballer Breakout <https://www.sparkfun.com/products/13169> SMD-4.6MMX2.8MM - 4.60mm x 2.80mm, surface mount Used on SparkFun SAMD21 Mini Breakout <https://www.sparkfun.com/products/13664> SMD-5.2MM, SMD-5.2-REDUNDANT - 5.2mm square, surface-mount Mini Pushbutton Switch - SMD <https://www.sparkfun.com/products/8720> (COM-08720) Used on Arduino Pro Mini <https://www.sparkfun.com/products/11114> REDUNDANT package connects both switch circuits together SMD-6.0X3.5MM - 6.0 x 3.5mm, surface mount Momentary Reset Switch SMD <https://www.sparkfun.com/products/8229> (COM-08229) SMD-6.2MM-TALL - 6.2mm square, surface mount Tactile Button - SMD (6mm) <https://www.sparkfun.com/products/12992> Used on SparkFun Digital Sandbox <https://www.sparkfun.com/products/12651> SMD-RIGHT-ANGLE - Right-angle, surface mount Used on SparkFun Block for Intel® Edison - Arduino <https://www.sparkfun.com/products/13036>; PROD_ID: SWCH-13065
TP1-TP23 = SparkFun-Connectors:TEST-POINT: SparkFun Test Points Bare copper test points for troubleshooting or In-Circuit-Testing. These are used by our Production team for verifying production board runs using pogo-pins on test beds. SparkFun Products: SparkFun LSM9DS1 Breakout <https://www.sparkfun.com/products/13284> SparkFun PSOC <https://www.sparkfun.com/products/13714> SparkFun Load Cell Amplifier <https://www.sparkfun.com/products/13879>
U1 = U-OSD3358-512M-BSM:OSD3358-512M-BSM: Octavo Systems LLC OSD335x Family SiP: 21mm x 21mm, 1.27mm pitch 256 pin BGA contains AM3358, 512MB DDR3, TPS65217, TL5209, 4KB EEPROM and passives. Commerical Temperature (case): 0C to 85C.; DESCRIPTION: 21mm 256 Ball Bga; DIGI-KEY_PART_NUMBER: 1676-1002-ND; DIGI-KEY_PURCHASE_URL: https://www.digikey.com/product-detail/en/octavo-systems-llc/OSD3358-512M-BSM/1676-1002-ND/7644258?utm_source=snapeda&utm_medium=aggregator&utm_campaign=symbol; MF: Octavo Systems; MP: OSD3358-512M-BSM; PACKAGE: BGA-400 Octavo Systems
U2 = GHI-IC:SN74LVC1G07DCK
U3 = U-TI-TPS2051C:TPS2051CDBVR; MANUFACTURER_PART_NUMBER: TPS2051CDBVR; VENDOR: Texas Instruments
U4 = U-Generic-eMMC-153pin:EMMC+RESET: eMMC (embedded multi-media card) memory with optional Reset function
Y2 = X-ECS-240-12-30BQ-AEN-TR:ECS-240-12-30BQ-AEN-TR
Y3 = SparkFun-Clocks:CRYSTAL-32.768KHZ: 32.768kHz Crystal Frequency: 32.768kHz Frequency Stability: ±20ppm Load Capacitance: 12.5pF (PTH-2X6 & SMD-3.2X1.5), 6pF (SMD-2X6) SparkFun Products: SparkFun BigTime Watch Kit <https://www.sparkfun.com/products/11734> SparkFun nRF52832 Breakout <https://www.sparkfun.com/products/13990> SparkFun Real Time Clock Module <https://www.sparkfun.com/products/12708>; PROD_ID: XTAL-13062